# Altium project ece315-F21.PrjPcb (part 1 of 2)
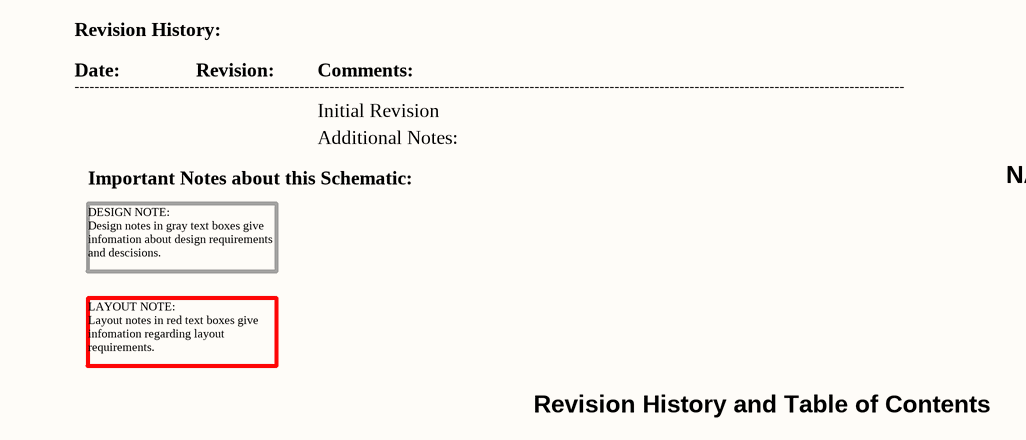
[diagram p0: 01-Revision_History_and_Contents.SchDoc]
8 sheets, 72 parts. Net scope: global (net labels, ports and power ports of the same name join across sheets).
Board file: ECE315_F21.PcbDoc
Sheets:
  01-Revision_History_and_Contents.SchDoc
  02-Power.SchDoc
  03_MCU.SchDoc
  04_Seven_Seg.SchDoc
  05_Seven_Seg.SchDoc
  06_CapTouch.SchDoc
  07_Buzzer.SchDoc
  08_Mechanicals.SchDoc

## Sheet 01-Revision_History_and_Contents.SchDoc: Revision History and Contents
size A; Date: 4/25/2017; ApprovedBy: JSK; CheckedBy: JSK; Author: JSK; CompanyName: University of Wisconsin; DrawnBy: JSK; Engineer: JSK; Organization: ECE 315; Address1: College of Engineering; Address2: 1415 Engineering Drive; Address3: Madison, WI 53706; Address4: ECE 453 Spring 2017; Revision: A; SheetNumber: 1; SheetTotal: 2

### Notes on the sheet
- Revision History:
- Date:
- ----------------------------------------------------------------------------------------------------------------------------------------------------------------------
- Revision:
- Comments:
- Initial Revision
- Important Notes about this Schematic:
- Additional Notes:
- NAME: <YOUR NAME>
- DESIGN NOTE:
  Design notes in gray text boxes give infomation about design requirements and descisions.
- LAYOUT NOTE:
  Layout notes in red text boxes give infomation regarding layout requirements.
- Revision History and Table of Contents

## Sheet 02-Power.SchDoc: ECE315 Analog
size A; Date: 4/25/2017; ApprovedBy: JSK; CheckedBy: JSK; Author: JSK; CompanyName: University of Wisconsin; DrawnBy: JSK; Engineer: JSK; Organization: ECE 315; Address1: College of Engineering; Address2: 1415 Engineering Drive; Address3: Madison, WI 53706; Address4: ECE 315 Fall 2017; Revision: A; SheetNumber: 2; SheetTotal: 2; AssemblyNumber: ECE315-F19; ApprovedDate: 04/02/2019
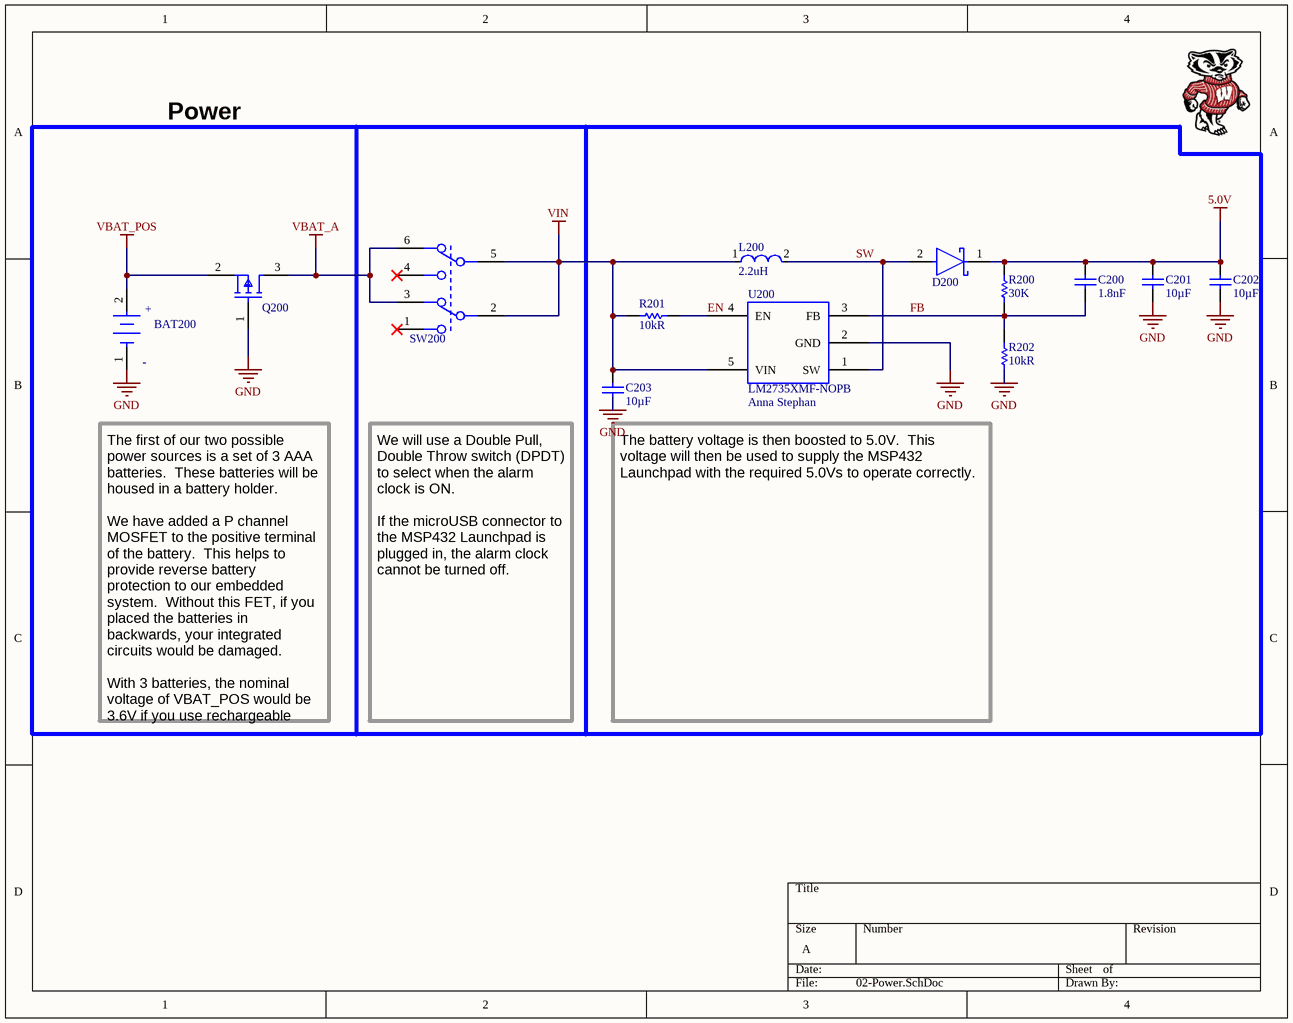
[diagram p1: 02-Power.SchDoc]

### Parts
BAT200  UNK_Keystone_2479_eec  [Keystone_2479_0]  (value not drawn)
C200  Capacitance: 1.8nF  [CAP_0805]  (hidden comment: CAP_0805_N_001_80)
C201  value 10µF  [CAP_0805]  (hidden comment: CAP_0805_U_010_00)
C202  value 10µF  [CAP_0805]  (hidden comment: CAP_0805_U_010_00)
C203  value 10µF  [CAP_0805]  (hidden comment: CAP_0805_U_010_00)
D200  SM5817PL-TP  [On_Semiconductor_425-04_IPC_A]  (value not drawn)
L200  Inductance: 2.2uH  [IND_TAIYO_NRS4018_TAY]  (hidden comment: NRS4018T2R2MDGJ)
Q200  SSM3J328R,LF  [SOT-23_M]  (value not drawn)
R200  30K  [RES_0805]
R201  Resistance: 10kR  [RES_0805]  (hidden comment: RES_0805_K_010.00)
R202  Resistance: 10kR  [RES_0805]  (hidden comment: RES_0805_K_010.00)
SW200  JS202011SCQN  [C&K_Components_0_MFG]  (value not drawn)
U200  Drawn_By: Anna Stephan  [LM2735-SOT23-S]  (hidden comment: LM2735XMF-NOPB)

### Blocks framed on the sheet
Power: BAT200 C200-C203 D200 L200 Q200 R200-R202 SW200 U200

### Nets
5.0V: C200.2 C201.2 C202.2 D200.1(C) R200.2
GND: BAT200.1(C) C201.1 C202.1 C203.1 Q200.1(Gate) R202.1 U200.2(GND)
VBAT_A: Q200.3(Drain) SW200.3 SW200.6
VBAT_POS: BAT200.2(A) Q200.2(Source)
VIN: C203.2 L200.1 R201.2 SW200.2 SW200.5 U200.5(VIN)
EN: R201.1 U200.4(EN)
FB: C200.1 R200.1 R202.2 U200.3(FB)
SW: D200.2(A) L200.2 U200.1(SW)

Not connected (* = marked no-connect by the designer): SW200 1* 4*

### Notes on the sheet
- The first of our two possible power sources is a set of 3 AAA batteries.  These batteries will be housed in a battery holder.
  We have added a P channel MOSFET to the positive terminal of the battery.  This helps to provide reverse battery protection to our embedded system.  Without this FET, if you placed the batteries in backwards, your integrated circuits would be damaged.
  With 3 batteries, the nominal voltage of VBAT_POS would be 3.6V if you use rechargeable NiMH batteries and 4.5V if you use lead acid batteries.
- (near C203) We will use a Double Pull, Double Throw switch (DPDT) to select when the alarm clock is ON.
  If the microUSB connector to the MSP432 Launchpad is plugged in, the alarm clock cannot be turned off.
- (near C203) The battery voltage is then boosted to 5.0V.  This voltage will then be used to supply the MSP432 Launchpad with the required 5.0Vs to operate correctly.
- (in symbol UNK_Keystone_2479_eec) +

### Library data of the parts
BAT200 = UNK_Keystone_2479_eec: BATTERY HOLDER AAA 3 CELL PC PIN; Part Number: 2479; Manufacturer 1: Keystone Electronics; Body Material: Polypropylene; Number of Batteries: 3; Wire/Cable Gauge: 26AWG; helpURL: https://upverter.com/upn/revision/5489a3afbecc8c6e/; ComponentLink2Description: Datasheet; Temperature: to; Package: CONN_BAT_HOLDER_3_AAA; Supplier 2: Mouser; Price: 1.03768733885; Supplier 1: Digi-Key; ComponentLink1URL: https://upverter.com/upn/revision/5489a3afbecc8c6e/; Supplier Part Number 2: 534-2479; Supplier Part Number 1: 36-2479-ND; Manufacturer: Keystone; ComponentLink1Description: Upverter; ComponentLink2URL: http://www.keyelco.com/product-pdf.cfm?p=1041; RoHS: TRUE; Mouser Part Number: 534-2479; Digikey Description: UNK HOLDER BATTERY 3CELL AAA PC MNT; Digikey Part Number: 36-2479-ND; Lead Free: yes; Mounting Type: PCB, Through Hole; Manufacturer Part Number 1: 2479; Category: Batteries and Accessories; Stock 1: 3670; Pricing 1: 1=1.71000, 25=1.49600, 100=1.19500, 250=1.09916, 500=1.03154, 1000=0.96389, 2500=0.87370, 5000=0.80043 (USD); Mount: Through Hole,PCB; Material: Steel,Plastic; Contact Material: Brass; Package Quantity: 1; Packaging: Bulk; Series: -; Number of Cells: 3; Termination: PC Pin; Contact Type: Spring; REACH SVHC: No SVHC; ComponentLink3URL: https://datasheet.ciiva.com/1391/1718224-1391618.pdf?src-supplier=Element14; ComponentLink3Description: https://datasheet.ciiva.com/1391/1718224-1391618.pdf?src-supplier=Element14; ComponentLink4URL: https://datasheet.ciiva.com/4/2479-4180.pdf?src-supplier=Digi-Key; ComponentLink4Description: https://datasheet.ciiva.com/4/2479-4180.pdf?src-supplier=Digi-Key; ComponentLink5URL: https://datasheet.ciiva.com/20221/18-3680-20221687.pdf?src-supplier=Rapid+Electronics; ComponentLink5Description: https://datasheet.ciiva.com/20221/18-3680-20221687.pdf?src-supplier=Rapid+Electronics
C200 = CAP_0805_N_001_80: MURATA - GRM2165C1H182JA01D - SMD Multilayer Ceramic Capacitor, 1800 pF, 50 V, 0805 [2012 Metric], ± 5%, C0G / NP0, GRM Series; Voltage Rating: 50V; Temperature Coefficient: 30ppm/°C; ComponentLink3URL: https://datasheet.ciiva.com/26920/getdatasheetpartid-355170-26920201.pdf; ComponentLink3Description: https://datasheet.ciiva.com/26920/getdatasheetpartid-355170-26920201.pdf; ComponentLink1URL: https://datasheet.ciiva.com/25730/cl21a106kpclqnc-25730594.pdf; ComponentLink1Description: https://datasheet.ciiva.com/25730/cl21a106kpclqnc-25730594.pdf; Supplier 1: Digi-Key; Supplier Part Number 1: 490-1626-1-ND; Manufacturer 1: Murata; Manufacturer Part Number 1: GRM2165C1H182JA01D; RoHS: Yes; Category: Ceramic Capacitors; Stock 1: 44565; Pricing 1: 1=0.20000, 10=0.14000, 50=0.08380, 100=0.07080, 500=0.04844, 1000=0.04285 (USD); Mount: Surface Mount; Case/Package: 0805; Case Code (Metric): 2012; Case Code (Imperial): 0805; Min Operating Temperature: -55°C; Max Operating Temperature: 125°C; Tolerance: 5%; Package Quantity: 1; Packaging: Tape and Reel; Voltage Rating (DC): 50V; Dielectric: C0G; Termination: SMD/SMT; Voltage: 50V; Series: GRM; Construction: Flat; Length: 2mm; Width: 0.049inch; Height: 0.6mm; Thickness: 0.028inch; Depth: 1.25mm; Radiation Hardening: No; REACH SVHC: No SVHC; Lead Free: Lead Free; RoHS Compliant: Yes; ComponentLink2URL: https://datasheet.ciiva.com/134/partnumbering-e-01-134098.pdf?src-supplier=Digi-Key; ComponentLink2Description: https://datasheet.ciiva.com/134/partnumbering-e-01-134098.pdf?src-supplier=Digi-Key; ComponentLink4URL: https://datasheet.ciiva.com/134/partnumbering-e-01-134100.pdf?src-supplier=Digi-Key; ComponentLink4Description: https://datasheet.ciiva.com/134/partnumbering-e-01-134100.pdf?src-supplier=Digi-Key; ComponentLink5URL: https://datasheet.ciiva.com/134/partnumbering-e-01-134099.pdf?src-supplier=Digi-Key; ComponentLink5Description: https://datasheet.ciiva.com/134/partnumbering-e-01-134099.pdf?src-supplier=Digi-Key
C201-C203 = CAP_0805_U_010_00: CAP CER 10UF 10V X5R 0805; Manufacturer: Samsung Electro-Mechanics America, Inc.; Manufacturer Part Number: CL21A106KPCLQNC; Tolerance: ±10%; Supplier 1: Digi-Key; Supplier Part Number 1: 1276-2402-1-ND; RoHS: RoHS Compliant; Category: Capacitors; Stock 1: 97192; Pricing 1: 1=0.2, 10=0.14, 25=0.1052, 50=0.0806, 100=0.0665, 500=0.0469, 1000=0.0385 (USD); Packaging: Cut Tape (CT); Voltage - Rated: 10V; Temperature Coefficient: X5R; Mounting Type: Surface Mount, MLCC; Operating Temperature: -55°C ~ 85°C; Applications: General Purpose; Ratings: -; Package / Case: 0805 (2012 Metric); Size / Dimension: 0.079" L x 0.049" W (2.00mm x 1.25mm); Height - Seated (Max): -; Thickness (Max): 0.037" (0.95mm); Lead Spacing: -; Features: -; Lead Style: -; ComponentLink1URL: http://media.digikey.com/pdf/Data%20Sheets/Samsung%20PDFs/CL21A106KPCLQNC_character.pdf; ComponentLink1Description: http://media.digikey.com/pdf/Data%20Sheets/Samsung%20PDFs/CL21A106KPCLQNC_character.pdf
D200 = SM5817PL-TP: DIODE SCHOTTKY 20V 1A SOD123FL; Forward Voltage: 450mV; Max Surge Current: 30A; Element Configuration: Single; Manufacturer 2: MCC; Manufacturer Part Number 2: SM5817PL-TP; RoHS: Yes; Category: Rectifier Diodes; Stock 2: 178040; Pricing 2: 1=0.46000, 10=0.31900, 100=0.16110, 500=0.13144, 1000=0.09752 (USD); Mount: Surface Mount; Number of Pins: 2; Min Operating Temperature: -65°C; Max Operating Temperature: 125°C; Packaging: Tape and Reel; Package Quantity: 1; Average Rectified Current: 1A; Peak Non-Repetitive Surge Current: 30A; Max Reverse Voltage (DC): 20V; Reverse Voltage: 20V; Radiation Hardening: No; RoHS Compliant: Yes; ComponentLink1URL: https://datasheet.ciiva.com/15200/getdatasheetpartid-487494-15200581.pdf?src-supplier=Verical; ComponentLink1Description: https://datasheet.ciiva.com/15200/getdatasheetpartid-487494-15200581.pdf?src-supplier=Verical; ComponentLink2URL: https://datasheet.ciiva.com/912/sm5817pl-sm5819plsod-123fl-912827.pdf?src-supplier=Digi-Key; ComponentLink2Description: https://datasheet.ciiva.com/912/sm5817pl-sm5819plsod-123fl-912827.pdf?src-supplier=Digi-Key; Supplier 1: Digi-Key; Supplier Part Number 1: SM5817PL-TPMSCT-ND
L200 = NRS4018T2R2MDGJ: Inductor Power Shielded Wirewound 2.2uH 20% 100KHz Ferrite 2.2A 0.0504Ohm DCR 1515 T/R; Manufacturer 1: Taiyo Yuden; Self Resonant Frequency: 60MHz; DC Resistance (DCR): 50.4mR; Max DC Current: 3A; ComponentLink1URL: https://datasheet.ciiva.com/8502/nr6028t2r2n-ss-8502679.pdf?src-supplier=Avnet; ComponentLink1Description: https://datasheet.ciiva.com/8502/nr6028t2r2n-ss-8502679.pdf?src-supplier=Avnet; ComponentLink2URL: https://datasheet.ciiva.com/15988/8nr6028t2r2n-15988110.pdf?src-supplier=Onlinecomponents.com; ComponentLink2Description: https://datasheet.ciiva.com/15988/8nr6028t2r2n-15988110.pdf?src-supplier=Onlinecomponents.com; ComponentLink3URL: https://datasheet.ciiva.com/7291/nr6028t2r2n-ss-7291637.pdf?src-supplier=Newark; ComponentLink3Description: https://datasheet.ciiva.com/7291/nr6028t2r2n-ss-7291637.pdf?src-supplier=Newark; ComponentLink4URL: https://datasheet.ciiva.com/1043/wound04-e-1043090.pdf?src-supplier=Digi-Key; ComponentLink4Description: https://datasheet.ciiva.com/1043/wound04-e-1043090.pdf?src-supplier=Digi-Key; ComponentLink5URL: https://datasheet.ciiva.com/1043/wound04-e-1043091.pdf?src-supplier=Digi-Key; ComponentLink5Description: https://datasheet.ciiva.com/1043/wound04-e-1043091.pdf?src-supplier=Digi-Key; ComponentLink6URL: https://datasheet.ciiva.com/1043/wound04-e-1043092.pdf?src-supplier=Digi-Key; ComponentLink6Description: https://datasheet.ciiva.com/1043/wound04-e-1043092.pdf?src-supplier=Digi-Key; Supplier 1: Digi-Key; Supplier Part Number 1: 587-2890-1-ND; Manufacturer Part Number 1: NRS4018T2R2MDGJ; RoHS: Yes; Category: Fixed Inductors; Stock 1: 291635; Pricing 1: 1=0.27000, 10=0.23800, 25=0.20840, 50=0.17860, 100=0.16370, 250=0.14884, 500=0.13990, 1000=0.10716 (USD); Mount: Surface Mount; Case/Package: Nonstandard; Number of Pins: 2; Core Material: Ferrite; Min Operating Temperature: -25°C; Max Operating Temperature: 125°C; Packaging: Tape and Reel; Tolerance: 20%; Package Quantity: 3500; Current Rating: 2.2A; Saturation Current: 3A; Shielding: Shielded; Resistor Type: Wirewound; Test Frequency: 100kHz; Termination: SMD/SMT; Inductance Tolerance: 20%; RMS Current (Irms): 2.2A; Series: NRS; Length: 4mm; Width: 0.157inch; Height: 1.8mm; Height - Seated (Max): 0.071inch; Depth: 4.2mm; Lead Pitch: 2.8mm; Radiation Hardening: No; Halogen Free: Halogen Free; Lead Free: Lead Free; RoHS Compliant: Yes; REACH SVHC: Unknown; ComponentLink7URL: https://datasheet.ciiva.com/8502/nrs4018t2r2mdgj-ss-8502646.pdf?src-supplier=Avnet; ComponentLink7Description: https://datasheet.ciiva.com/8502/nrs4018t2r2mdgj-ss-8502646.pdf?src-supplier=Avnet; ComponentLink8URL: https://datasheet.ciiva.com/7291/nrs4018t2r2mdgj-ss-7291680.pdf?src-supplier=Newark; ComponentLink8Description: https://datasheet.ciiva.com/7291/nrs4018t2r2mdgj-ss-7291680.pdf?src-supplier=Newark; ComponentLink9URL: https://datasheet.ciiva.com/25607/0900766b810b3cd2-25607949.pdf?src-supplier=RSComponents; ComponentLink9Description: https://datasheet.ciiva.com/25607/0900766b810b3cd2-25607949.pdf?src-supplier=RSComponents
Q200 = SSM3J328R,LF: MOSFET P-CH 20V 6A SOT23F; Manufacturer 1: Toshiba; Rds On Max: 29.8mR; Input Capacitance: 840pF; Max Power Dissipation: 1W; Gate to Source Voltage (Vgs): 8V; Turn-Off Delay Time: 107ns; Turn-On Delay Time: 32ns; Number of Channels: 1; Drain to Source Resistance: 47.4mR; Power Dissipation: 2W; Element Configuration: Single; Drain to Source Breakdown Voltage: -20V; Polarity: P-CHANNEL; Supplier 1: Digi-Key; Supplier Part Number 1: SSM3J328RLFCT-ND; Manufacturer Part Number 1: SSM3J328R,LF; RoHS: Yes; Category: MOSFETs; Stock 1: 476474; Pricing 1: 1=0.43000, 10=0.32200, 25=0.29040, 100=0.20060, 500=0.13728, 1000=0.10560 (USD); Mount: Surface Mount; Case/Package: SOT-23-3; Number of Pins: 3; Min Operating Temperature: -55°C; Max Operating Temperature: 150°C; Package Quantity: 3000; Packaging: Tape and Reel; Drain to Source Voltage (Vdss): 20V; Continuous Drain Current (ID): 6A; Number of Elements: 1; Radiation Hardening: No; RoHS Compliant: Yes; ComponentLink1URL: https://datasheet.ciiva.com/11158/ssm3j328r-datasheet-en-20140301-11158652.pdf?src-supplier=Avnet; ComponentLink1Description: https://datasheet.ciiva.com/11158/ssm3j328r-datasheet-en-20140301-11158652.pdf?src-supplier=Avnet; ComponentLink2URL: https://datasheet.ciiva.com/24106/ssm3j328r-datasheet-en-20140301-24106699.pdf?src-supplier=Mouser; ComponentLink2Description: https://datasheet.ciiva.com/24106/ssm3j328r-datasheet-en-20140301-24106699.pdf?src-supplier=Mouser; ComponentLink3URL: https://datasheet.ciiva.com/45425/ssm3j328r-datasheet-en-20140301-45425519.pdf?src-supplier=Digi-Key; ComponentLink3Description: https://datasheet.ciiva.com/45425/ssm3j328r-datasheet-en-20140301-45425519.pdf?src-supplier=Digi-Key; ComponentLink4URL: https://datasheet.ciiva.com/45425/ssm3j328r-datasheet-en-20140301-45425813.pdf?src-supplier=Digi-Key; ComponentLink4Description: https://datasheet.ciiva.com/45425/ssm3j328r-datasheet-en-20140301-45425813.pdf?src-supplier=Digi-Key
R200 = RES_0805_K_030.00: Res Thick Film 0805 30K Ohm 1% 0.125W(1/8W) ±100ppm/°C Pad SMD Automotive T/R; Manufacturer 1: Panasonic; Manufacturer Part Number 1: ERJ-6ENF3002V; Power Rating: 125mW; Voltage Rating: 150V; Supplier 1: Digi-Key; Supplier Part Number 1: P30.0KCCT-ND; RoHS: Yes; Category: Chip SMD Resistors; Stock 1: 296893; Pricing 1: 1=0.10000, 10=0.07500, 100=0.02880, 1000=0.01265, 2500=0.01092 (USD); Mount: Surface Mount; Case/Package: 0805; Case Code (Metric): 2012; Case Code (Imperial): 0805; Contact Plating: Tin; Weight: 0.000194oz; Min Operating Temperature: -55°C; Max Operating Temperature: 155°C; Tolerance: 1%; Packaging: Tape and Reel; Package Quantity: 1; Resistor Type: Thick Film; Number of Terminations: 2; Termination: SMD/SMT; Temperature Coefficient: 100ppm/°C; Max Power Dissipation: 125mW; Voltage Rating (DC): 150V; Features: Automotive AEC-Q200; Series: ERJ; Technology: THICK FILM; Resistance Tolerance: 1%; Construction: Rectangular; Length: 2mm; Width: 0.049inch; Height: 0.6mm; Depth: 1.25mm; Radiation Hardening: No; REACH SVHC: Unknown; Military Standard: Not; Lead Free: Lead Free; RoHS Compliant: Yes; ComponentLink1URL: https://datasheet.ciiva.com/11821/0900766b80f80784-11821600.pdf?src-supplier=RSComponents; ComponentLink1Description: https://datasheet.ciiva.com/11821/0900766b80f80784-11821600.pdf?src-supplier=RSComponents; ComponentLink2URL: https://datasheet.ciiva.com/9117/aoa0000ce2-9117485.pdf?src-supplier=Avnet; ComponentLink2Description: https://datasheet.ciiva.com/9117/aoa0000ce2-9117485.pdf?src-supplier=Avnet; ComponentLink3URL: https://datasheet.ciiva.com/24124/aoa0000ce2-24124393.pdf?src-supplier=Mouser; ComponentLink3Description: https://datasheet.ciiva.com/24124/aoa0000ce2-24124393.pdf?src-supplier=Mouser; ComponentLink4URL: https://datasheet.ciiva.com/30169/aoa0000ce2-30169447.pdf?src-supplier=Onlinecomponents.com; ComponentLink4Description: https://datasheet.ciiva.com/30169/aoa0000ce2-30169447.pdf?src-supplier=Onlinecomponents.com; ComponentLink5URL: https://datasheet.ciiva.com/17210/aoa0000ce2-17210478.pdf?src-supplier=Avnet+Europe; ComponentLink5Description: https://datasheet.ciiva.com/17210/aoa0000ce2-17210478.pdf?src-supplier=Avnet+Europe; ComponentLink6URL: https://datasheet.ciiva.com/22673/1678782-22673293.pdf?src-supplier=Element14; ComponentLink6Description: https://datasheet.ciiva.com/22673/1678782-22673293.pdf?src-supplier=Element14; ComponentLink7URL: https://datasheet.ciiva.com/28565/1694929-28565193.pdf?src-supplier=Element14; ComponentLink7Description: https://datasheet.ciiva.com/28565/1694929-28565193.pdf?src-supplier=Element14; ComponentLink8URL: https://datasheet.ciiva.com/46441/1678782-46441405.pdf?src-supplier=Element14; ComponentLink8Description: https://datasheet.ciiva.com/46441/1678782-46441405.pdf?src-supplier=Element14; ComponentLink9URL: https://datasheet.ciiva.com/46441/1678782-46441406.pdf?src-supplier=Element14; ComponentLink9Description: https://datasheet.ciiva.com/46441/1678782-46441406.pdf?src-supplier=Element14; ComponentLink10URL: https://datasheet.ciiva.com/16512/aoa0000ce2-16512236.pdf?src-supplier=Avnet+Asia; ComponentLink10Description: https://datasheet.ciiva.com/16512/aoa0000ce2-16512236.pdf?src-supplier=Avnet+Asia; ComponentLink11URL: https://datasheet.ciiva.com/7711/1678782-7711062.pdf?src-supplier=Element14; ComponentLink11Description: https://datasheet.ciiva.com/7711/1678782-7711062.pdf?src-supplier=Element14; Resistance: 30K
R201 R202 = RES_0805_K_010.00: RES SMD 10K OHM 1% 1/8W 0805; Manufacturer 1: Yageo; Manufacturer Part Number 1: RC0805FR-0710KL; Temperature Coefficient: 100ppm/°C; Power Rating: 125mW; Voltage Rating: 150V; Supplier 1: Digi-Key; Supplier Part Number 1: 311-10.0KCRCT-ND; Stock 1: 7562122; Pricing 1: 1=0.10000, 10=0.04200, 100=0.01690, 1000=0.00759, 2500=0.00659 (USD); RoHS: Yes; Case/Package: 0805; Case Code (Imperial): 0805; Case Code (Metric): 2012; Min Operating Temperature: -55°C; Max Operating Temperature: 155°C; Tolerance: 1%; Packaging: Tape and Reel; Features: Moisture Resistant; Termination: SMD/SMT; Number of Terminations: 2; Military Standard: Not; Max Power Dissipation: 125mW; Package Quantity: 1; Length: 2mm; Height: 0.024inch; Width: 0.049inch; Depth: 1.25mm; Lead Free: Lead Free; REACH SVHC: Unknown; ComponentLink1URL: https://datasheet.ciiva.com/11808/0900766b8106beab-11808151.pdf?src-supplier=RSComponents; ComponentLink1Description: https://datasheet.ciiva.com/11808/0900766b8106beab-11808151.pdf?src-supplier=RSComponents; ComponentLink2URL: https://datasheet.ciiva.com/12669/rc0805-12669688.pdf?src-supplier=Mouser; ComponentLink2Description: https://datasheet.ciiva.com/12669/rc0805-12669688.pdf?src-supplier=Mouser; ComponentLink3URL: https://datasheet.ciiva.com/46447/444164-46447563.pdf?src-supplier=Element14; ComponentLink3Description: https://datasheet.ciiva.com/46447/444164-46447563.pdf?src-supplier=Element14; ComponentLink4URL: https://datasheet.ciiva.com/2456/pyu-r-int-thick-7-2456972.pdf?src-supplier=Digi-Key; ComponentLink4Description: https://datasheet.ciiva.com/2456/pyu-r-int-thick-7-2456972.pdf?src-supplier=Digi-Key; ComponentLink5URL: https://datasheet.ciiva.com/2456/pyu-r-int-thick-7-2456973.pdf?src-supplier=Digi-Key; ComponentLink5Description: https://datasheet.ciiva.com/2456/pyu-r-int-thick-7-2456973.pdf?src-supplier=Digi-Key; ComponentLink6URL: https://datasheet.ciiva.com/2456/pyu-r-int-thick-7-2456974.pdf?src-supplier=Digi-Key; ComponentLink6Description: https://datasheet.ciiva.com/2456/pyu-r-int-thick-7-2456974.pdf?src-supplier=Digi-Key; ComponentLink7URL: https://datasheet.ciiva.com/16747/rc0805-16747087.pdf?src-supplier=Future+Electronics; ComponentLink7Description: https://datasheet.ciiva.com/16747/rc0805-16747087.pdf?src-supplier=Future+Electronics; Category: Chip SMD Resistors; Size Code: 0805; Resistor Type: Thick Film; Series: RC; Construction: Rectangular; Resistance Tolerance: 1%; Technology: THICK FILM; RoHS Compliant: Yes
SW200 = JS202011SCQN: C & K COMPONENTS - JS202011SCQN - SWITCH, DPDT, 0.6A, 6VDC, SMD; Manufacturer 1: ITT C&K; Actuator Material: Nylon,Polyamide,PA46; Actuator Color: Black; Voltage Rating (DC): 6V; Current Rating: 300mA; Electrical Life: 5000Cycles; Switch Function: On-On; Contact Resistance: 70mR; Switch Travel: 2mm; Actuator Type: Standard; Supplier 1: Digi-Key; Supplier Part Number 1: 401-2002-1-ND; Manufacturer Part Number 1: JS202011SCQN; RoHS: Yes; Category: Slide Switches; Stock 1: 21096; Pricing 1: 1=0.55000, 10=0.53000, 25=0.51040, 100=0.44180, 250=0.40252, 500=0.37306 (USD); Mount: Surface Mount; Contact Plating: Silver; Contact Material: Copper Alloy; Housing Material: Nylon; Min Operating Temperature: -20°C; Max Operating Temperature: 85°C; Throw Configuration: DPDT; Packaging: Tape and Reel; Package Quantity: 1; Termination: Gull Wing; Max Voltage Rating (DC): 6V; Series: JS; Max Current Rating: 300mA; Contact Current Rating: 300mA; Orientation: Vertical; Length: 9mm; Depth: 7.5mm; Actuator Length: 2mm; Radiation Hardening: No; REACH SVHC: No SVHC; Lead Free: Lead Free; Flammability Rating: UL94 V-2; ComponentLink1URL: https://datasheet.ciiva.com/2889/js-29aug13-2889127.pdf?src-supplier=Digi-Key; ComponentLink1Description: https://datasheet.ciiva.com/2889/js-29aug13-2889127.pdf?src-supplier=Digi-Key; ComponentLink2URL: https://datasheet.ciiva.com/23829/1707718-23829488.pdf?src-supplier=Newark; ComponentLink2Description: https://datasheet.ciiva.com/23829/1707718-23829488.pdf?src-supplier=Newark; ComponentLink3URL: https://datasheet.ciiva.com/8625/js-9dec14-8625470.pdf?src-supplier=Avnet; ComponentLink3Description: https://datasheet.ciiva.com/8625/js-9dec14-8625470.pdf?src-supplier=Avnet; ComponentLink4URL: https://datasheet.ciiva.com/2889/js-15sept15-2889128.pdf?src-supplier=Digi-Key; ComponentLink4Description: https://datasheet.ciiva.com/2889/js-15sept15-2889128.pdf?src-supplier=Digi-Key; ComponentLink5URL: https://datasheet.ciiva.com/2889/js-15sept15-2889129.pdf?src-supplier=Digi-Key; ComponentLink5Description: https://datasheet.ciiva.com/2889/js-15sept15-2889129.pdf?src-supplier=Digi-Key; ComponentLink6URL: https://datasheet.ciiva.com/22630/1707718-22630697.pdf?src-supplier=Element14; ComponentLink6Description: https://datasheet.ciiva.com/22630/1707718-22630697.pdf?src-supplier=Element14
U200 = LM2735XMF-NOPB: IC REG MULT CONFG ADJ 2.1A SOT23; Manufacturer 1: TI National Semiconductor; Max Input Voltage: 5.5V; Max Output Current: 3A; Min Supply Voltage: 2.7V; Output Voltage: 24V; Switching Frequency: 1.6MHz; Nominal Supply Current: 500uA; Efficiency: 90%; Number of Outputs: 1; Synchronous Rectifier: No; Min Output Voltage: 3V; Quiescent Current: 7mA; Topology: Boost,SEPIC; Output Type: Adjustable; Supplier 1: Digi-Key; RoHS: Yes; Category: Voltage Regulators - Switching; Stock 1: 5135; Pricing 1: 1=2.27000, 10=2.03900, 25=1.92400, 100=1.63920, 250=1.53912, 500=1.34672 (USD); Mount: Surface Mount; Case/Package: SOT-23; Number of Pins: 5; Contact Plating: Tin,Matte; Min Operating Temperature: -40°C; Max Operating Temperature: 125°C; Output Current: 3A; Min Input Voltage: 2.7V; Packaging: Tape and Reel; Package Quantity: 1000; Max Output Voltage: 24V; Operating Supply Voltage: 5.5V; Series: LM2735; Supply Current: 500uA; Length: 2.92mm; Width: 1.6mm; Height: 1.02mm; Radiation Hardening: No; REACH SVHC: No SVHC; Lead Free: Lead Free; RoHS Compliant: Yes; ComponentLink1URL: https://datasheet.ciiva.com/22669/1802021-22669478.pdf?src-supplier=Element14; ComponentLink1Description: https://datasheet.ciiva.com/22669/1802021-22669478.pdf?src-supplier=Element14; Supplier Part Number 1: LM2735XMF/NOPBCT-ND

## Sheet 03_MCU.SchDoc: ECE315 MCU
size A; Date: 4/25/2017; ApprovedBy: JSK; CheckedBy: JSK; Author: JSK; CompanyName: University of Wisconsin; DrawnBy: JSK; Engineer: JSK; Organization: ECE 315; Address1: College of Engineering; Address2: 1415 Engineering Drive; Address3: Madison, WI 53706; Address4: ECE 315 Fall 2017; Revision: A; SheetNumber: 3; SheetTotal: 6; AssemblyNumber: ECE315-F19; ApprovedDate: 04/02/2019
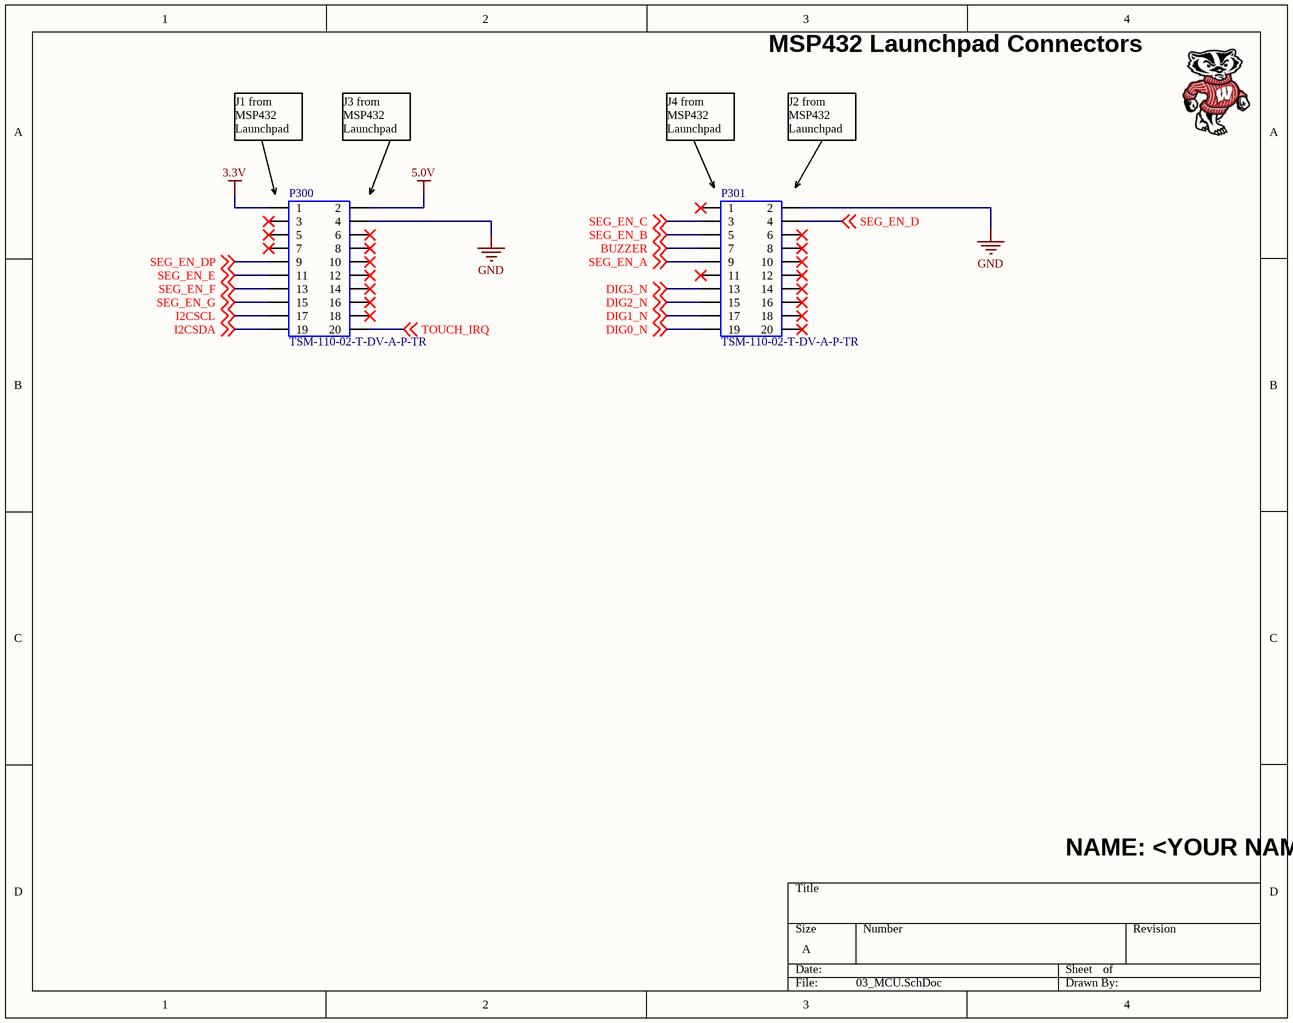
[diagram p2: 03_MCU.SchDoc]

### Parts
P300  Manufacturer Part Number: TSM-110-02-T-DV-A-P-TR  [TMS-110-01-T-DV-A]  (hidden comment: 20 Pin SMD)
P301  Manufacturer Part Number: TSM-110-02-T-DV-A-P-TR  [TMS-110-01-T-DV-A]  (hidden comment: 20 Pin SMD)

### Nets
3.3V: P300.1
5.0V: P300.2
GND: P300.4 P301.2
BUZZER: P301.7 ; off-sheet BUZZER
DIG0_N: P301.19 ; off-sheet DIG0_N
DIG1_N: P301.17 ; off-sheet DIG1_N
DIG2_N: P301.15 ; off-sheet DIG2_N
DIG3_N: P301.13 ; off-sheet DIG3_N
I2CSCL: P300.17 ; off-sheet I2CSCL
I2CSDA: P300.19 ; off-sheet I2CSDA
SEG_EN_A: P301.9 ; off-sheet SEG_EN_A
SEG_EN_B: P301.5 ; off-sheet SEG_EN_B
SEG_EN_C: P301.3 ; off-sheet SEG_EN_C
SEG_EN_D: P301.4 ; off-sheet SEG_EN_D
SEG_EN_DP: P300.9 ; off-sheet SEG_EN_DP
SEG_EN_E: P300.11 ; off-sheet SEG_EN_E
SEG_EN_F: P300.13 ; off-sheet SEG_EN_F
SEG_EN_G: P300.15 ; off-sheet SEG_EN_G
TOUCH_IRQ: P300.20 ; off-sheet TOUCH_IRQ

Not connected (* = marked no-connect by the designer): P300 3* 5* 6* 7* 8* 10* 12* 14* 16* 18*; P301 1* 6* 8* 10* 11* 12* 14* 16* 18* 20*

### Notes on the sheet
- MSP432 Launchpad Connectors
- J1 from MSP432 Launchpad
- J3 from MSP432 Launchpad
- J4 from MSP432 Launchpad
- J2 from MSP432 Launchpad
- NAME: <YOUR NAME>

### Library data of the parts
P300 P301 = TSM-110-02-T-DV-A: Conn Unshrouded Header HDR 20 POS 2.54mm Solder ST SMD Tube; Supplier 1: Newark; Supplier Part Number 1: 78P2391

## Sheet 04_Seven_Seg.SchDoc: ECE315 Analog
size A; Date: 4/25/2017; ApprovedBy: JSK; CheckedBy: JSK; Author: JSK; CompanyName: University of Wisconsin; DrawnBy: JSK; Engineer: JSK; Organization: ECE 315; Address1: College of Engineering; Address2: 1415 Engineering Drive; Address3: Madison, WI 53706; Address4: ECE 315 Fall 2017; Revision: A; SheetNumber: 2; SheetTotal: 2; AssemblyNumber: ECE315-F19; ApprovedDate: 04/02/2019
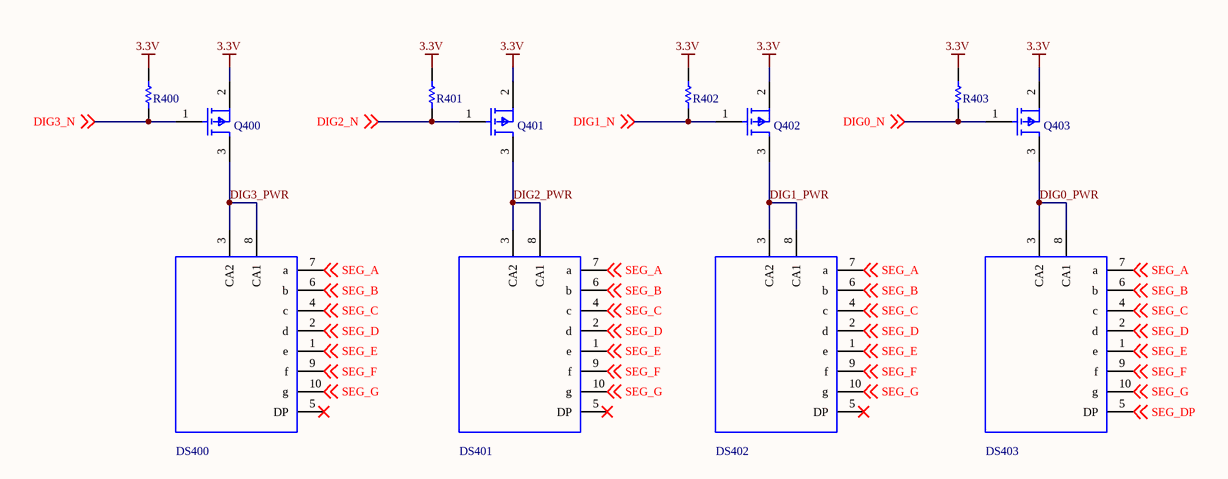
[diagram p3: 04_Seven_Seg.SchDoc]

### Parts
DS400  ACSA56-41CGKWA-F01  [ACSA56-41CGKWA-F01]  (value not drawn)
DS401  ACSA56-41CGKWA-F01  [ACSA56-41CGKWA-F01]  (value not drawn)
DS402  ACSA56-41CGKWA-F01  [ACSA56-41CGKWA-F01]  (value not drawn)
DS403  ACSA56-41CGKWA-F01  [ACSA56-41CGKWA-F01]  (value not drawn)
Q400  SSM3J328R,LF  [SOT-23_M]  (value not drawn)
Q401  SSM3J328R,LF  [SOT-23_M]  (value not drawn)
Q402  SSM3J328R,LF  [SOT-23_M]  (value not drawn)
Q403  SSM3J328R,LF  [SOT-23_M]  (value not drawn)
R400  RES_0805_K_010.00  [RES_0805]  (value not drawn)
R401  RES_0805_K_010.00  [RES_0805]  (value not drawn)
R402  RES_0805_K_010.00  [RES_0805]  (value not drawn)
R403  RES_0805_K_010.00  [RES_0805]  (value not drawn)

### Nets
3.3V: Q400.2(Source) Q401.2(Source) Q402.2(Source) Q403.2(Source) R400.2 R401.2 R402.2 R403.2
DIG0_N: Q403.1(Gate) R403.1 ; off-sheet DIG0_N
DIG0_PWR: DS403.3(CA2) DS403.8(CA1) Q403.3(Drain)
DIG1_N: Q402.1(Gate) R402.1 ; off-sheet DIG1_N
DIG1_PWR: DS402.3(CA2) DS402.8(CA1) Q402.3(Drain)
DIG2_N: Q401.1(Gate) R401.1 ; off-sheet DIG2_N
DIG2_PWR: DS401.3(CA2) DS401.8(CA1) Q401.3(Drain)
DIG3_N: Q400.1(Gate) R400.1 ; off-sheet DIG3_N
DIG3_PWR: DS400.3(CA2) DS400.8(CA1) Q400.3(Drain)
SEG_A: DS400.7(a) DS401.7(a) DS402.7(a) DS403.7(a) ; off-sheet SEG_A
SEG_B: DS400.6(b) DS401.6(b) DS402.6(b) DS403.6(b) ; off-sheet SEG_B
SEG_C: DS400.4(c) DS401.4(c) DS402.4(c) DS403.4(c) ; off-sheet SEG_C
SEG_D: DS400.2(d) DS401.2(d) DS402.2(d) DS403.2(d) ; off-sheet SEG_D
SEG_DP: DS403.5(DP) ; off-sheet SEG_DP
SEG_E: DS400.1(e) DS401.1(e) DS402.1(e) DS403.1(e) ; off-sheet SEG_E
SEG_F: DS400.9(f) DS401.9(f) DS402.9(f) DS403.9(f) ; off-sheet SEG_F
SEG_G: DS400.10(g) DS401.10(g) DS402.10(g) DS403.10(g) ; off-sheet SEG_G

Not connected (* = marked no-connect by the designer): DS400 5(DP)*; DS401 5(DP)*; DS402 5(DP)*

### Library data of the parts
DS400-DS403 = ACSA56-41CGKWA-F01: DISPLAY 0.56" SGL 574NM GRN SMD; Manufacturer 1: Kingbright; Color: Green; Power Consumption: 75mW; Number of Characters: 1; Element Configuration: Common Anode; Forward Current: 30mA; Forward Voltage: 2.1V; Wavelength: 570nm; Test Current: 20mA; Luminous Intensity: 25mcd; Display Type: Segment; Supplier 1: Digi-Key; Supplier Part Number 1: 754-1033-1-ND; Manufacturer Part Number 1: ACSA56-41CGKWA-F01; RoHS: Yes; Category: LED Displays; Stock 1: 38128; Pricing 1: 1=3.38000, 10=2.25300, 100=1.73360 (USD); Case/Package: SMD/SMT; Min Operating Temperature: -40°C; Max Operating Temperature: 85°C; Package Quantity: 400; Max Power Dissipation: 75mW; Illumination Color: Green; Packaging: Rail/Tube; Operating Supply Voltage: 2.1V; Width: 0.488inch; Height: 0.669inch; RoHS Compliant: Yes; Lead Free: Lead Free; ComponentLink1URL: https://datasheet.ciiva.com/2103/acsa56-41cgkwa-f01-2103794.pdf?src-supplier=Digi-Key; ComponentLink1Description: https://datasheet.ciiva.com/2103/acsa56-41cgkwa-f01-2103794.pdf?src-supplier=Digi-Key; ComponentLink2URL: https://datasheet.ciiva.com/4421/acsa56-41cgkwa-f01-17964-4421697.pdf?src-supplier=Mouser; ComponentLink2Description: https://datasheet.ciiva.com/4421/acsa56-41cgkwa-f01-17964-4421697.pdf?src-supplier=Mouser; ComponentLink3URL: https://datasheet.ciiva.com/16287/acsa56-41cgkwa-f01-16287523.pdf?src-supplier=Future+Electronics; ComponentLink3Description: https://datasheet.ciiva.com/16287/acsa56-41cgkwa-f01-16287523.pdf?src-supplier=Future+Electronics; ComponentLink4URL: https://datasheet.ciiva.com/2103/acsa56-41cgkwa-f01-2103795.pdf?src-supplier=Digi-Key; ComponentLink4Description: https://datasheet.ciiva.com/2103/acsa56-41cgkwa-f01-2103795.pdf?src-supplier=Digi-Key; ComponentLink5URL: https://datasheet.ciiva.com/2103/acsa56-41cgkwa-f01-2103796.pdf?src-supplier=Digi-Key; ComponentLink5Description: https://datasheet.ciiva.com/2103/acsa56-41cgkwa-f01-2103796.pdf?src-supplier=Digi-Key
Q400-Q403 = SSM3J328R,LF: as Q200 on sheet 02-Power; Supplier 1: Digi-Key; Supplier Part Number 1: SSM3J328RLFCT-ND; Manufacturer Part Number 1: SSM3J328R,LF; RoHS: Yes; Category: MOSFETs; Stock 1: 476474; Pricing 1: 1=0.43000, 10=0.32200, 25=0.29040, 100=0.20060, 500=0.13728, 1000=0.10560 (USD); Mount: Surface Mount; Case/Package: SOT-23-3; Number of Pins: 3; Min Operating Temperature: -55°C; Max Operating Temperature: 150°C; Package Quantity: 3000; Packaging: Tape and Reel; Drain to Source Voltage (Vdss): 20V; Continuous Drain Current (ID): 6A; Number of Elements: 1; Radiation Hardening: No; RoHS Compliant: Yes; ComponentLink1URL: https://datasheet.ciiva.com/11158/ssm3j328r-datasheet-en-20140301-11158652.pdf?src-supplier=Avnet; ComponentLink1Description: https://datasheet.ciiva.com/11158/ssm3j328r-datasheet-en-20140301-11158652.pdf?src-supplier=Avnet; ComponentLink2URL: https://datasheet.ciiva.com/24106/ssm3j328r-datasheet-en-20140301-24106699.pdf?src-supplier=Mouser; ComponentLink2Description: https://datasheet.ciiva.com/24106/ssm3j328r-datasheet-en-20140301-24106699.pdf?src-supplier=Mouser; ComponentLink3URL: https://datasheet.ciiva.com/45425/ssm3j328r-datasheet-en-20140301-45425519.pdf?src-supplier=Digi-Key; ComponentLink3Description: https://datasheet.ciiva.com/45425/ssm3j328r-datasheet-en-20140301-45425519.pdf?src-supplier=Digi-Key; ComponentLink4URL: https://datasheet.ciiva.com/45425/ssm3j328r-datasheet-en-20140301-45425813.pdf?src-supplier=Digi-Key; ComponentLink4Description: https://datasheet.ciiva.com/45425/ssm3j328r-datasheet-en-20140301-45425813.pdf?src-supplier=Digi-Key
R400-R403 = RES_0805_K_010.00: RES SMD 10K OHM 1% 1/8W 0805; Manufacturer 1: Yageo; Manufacturer Part Number 1: RC0805FR-0710KL; Temperature Coefficient: 100ppm/°C; Power Rating: 125mW; Voltage Rating: 150V; Resistance: 10kR; Supplier 1: Digi-Key; Supplier Part Number 1: 311-10.0KCRCT-ND; Stock 1: 7562122; Pricing 1: 1=0.10000, 10=0.04200, 100=0.01690, 1000=0.00759, 2500=0.00659 (USD); RoHS: Yes; Case/Package: 0805; Case Code (Imperial): 0805; Case Code (Metric): 2012; Min Operating Temperature: -55°C; Max Operating Temperature: 155°C; Tolerance: 1%; Packaging: Tape and Reel; Features: Moisture Resistant; Termination: SMD/SMT; Number of Terminations: 2; Military Standard: Not; Max Power Dissipation: 125mW; Package Quantity: 1; Length: 2mm; Height: 0.024inch; Width: 0.049inch; Depth: 1.25mm; Lead Free: Lead Free; REACH SVHC: Unknown; ComponentLink1URL: https://datasheet.ciiva.com/11808/0900766b8106beab-11808151.pdf?src-supplier=RSComponents; ComponentLink1Description: https://datasheet.ciiva.com/11808/0900766b8106beab-11808151.pdf?src-supplier=RSComponents; ComponentLink2URL: https://datasheet.ciiva.com/12669/rc0805-12669688.pdf?src-supplier=Mouser; ComponentLink2Description: https://datasheet.ciiva.com/12669/rc0805-12669688.pdf?src-supplier=Mouser; ComponentLink3URL: https://datasheet.ciiva.com/46447/444164-46447563.pdf?src-supplier=Element14; ComponentLink3Description: https://datasheet.ciiva.com/46447/444164-46447563.pdf?src-supplier=Element14; ComponentLink4URL: https://datasheet.ciiva.com/2456/pyu-r-int-thick-7-2456972.pdf?src-supplier=Digi-Key; ComponentLink4Description: https://datasheet.ciiva.com/2456/pyu-r-int-thick-7-2456972.pdf?src-supplier=Digi-Key; ComponentLink5URL: https://datasheet.ciiva.com/2456/pyu-r-int-thick-7-2456973.pdf?src-supplier=Digi-Key; ComponentLink5Description: https://datasheet.ciiva.com/2456/pyu-r-int-thick-7-2456973.pdf?src-supplier=Digi-Key; ComponentLink6URL: https://datasheet.ciiva.com/2456/pyu-r-int-thick-7-2456974.pdf?src-supplier=Digi-Key; ComponentLink6Description: https://datasheet.ciiva.com/2456/pyu-r-int-thick-7-2456974.pdf?src-supplier=Digi-Key; ComponentLink7URL: https://datasheet.ciiva.com/16747/rc0805-16747087.pdf?src-supplier=Future+Electronics; ComponentLink7Description: https://datasheet.ciiva.com/16747/rc0805-16747087.pdf?src-supplier=Future+Electronics; Category: Chip SMD Resistors; Size Code: 0805; Resistor Type: Thick Film; Series: RC; Construction: Rectangular; Resistance Tolerance: 1%; Technology: THICK FILM; RoHS Compliant: Yes

## Sheet 05_Seven_Seg.SchDoc: ECE315 Analog
size A; Date: 4/25/2017; ApprovedBy: JSK; CheckedBy: JSK; Author: JSK; CompanyName: University of Wisconsin; DrawnBy: JSK; Engineer: JSK; Organization: ECE 315; Address1: College of Engineering; Address2: 1415 Engineering Drive; Address3: Madison, WI 53706; Address4: ECE 315 Fall 2017; Revision: A; SheetNumber: 2; SheetTotal: 2; AssemblyNumber: ECE315-F19; ApprovedDate: 04/02/2019
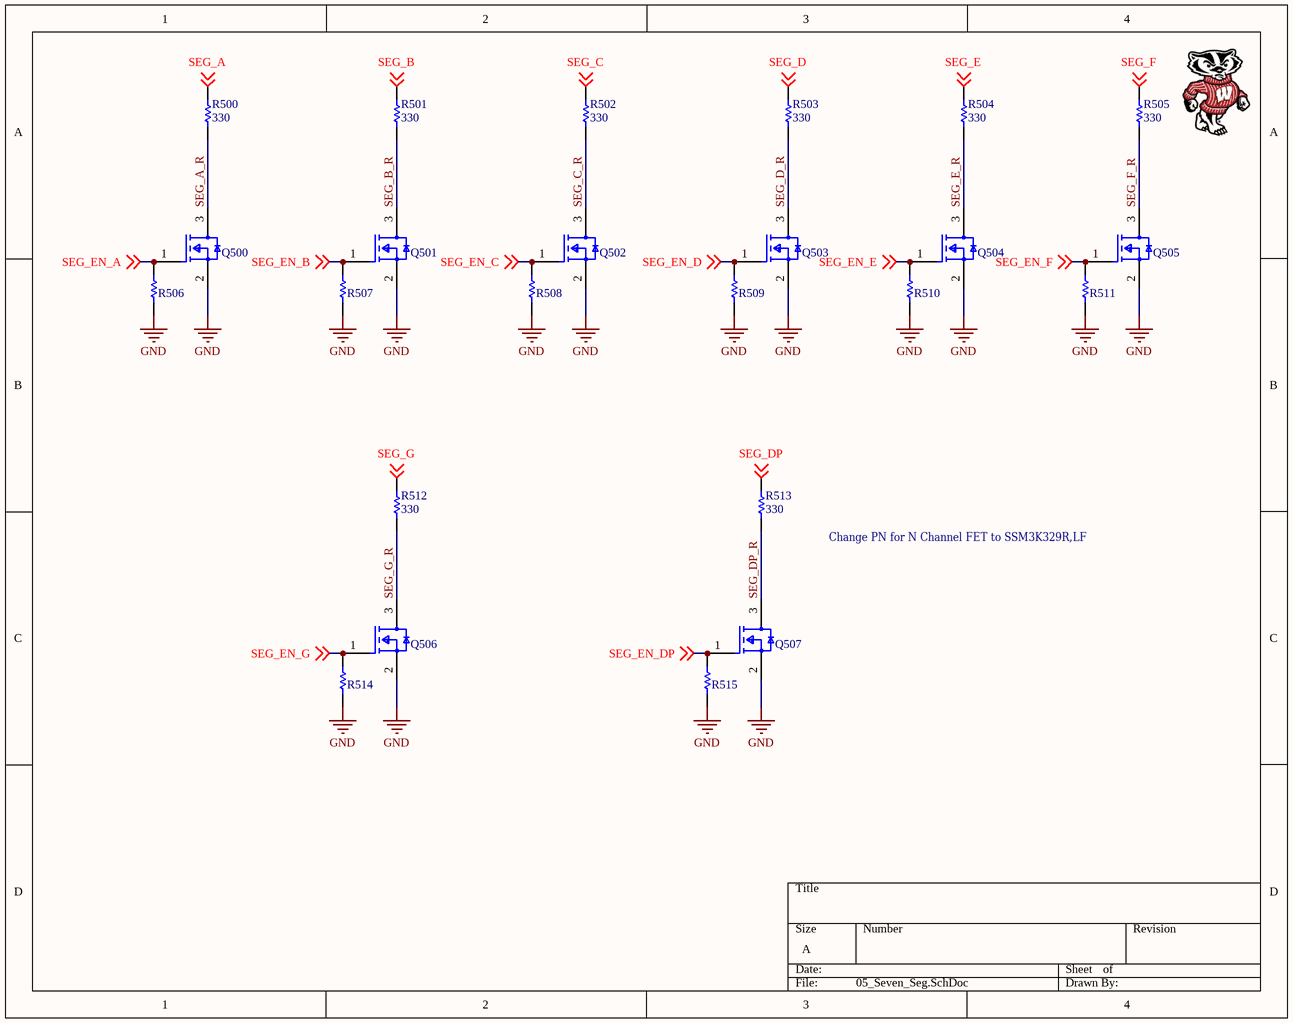
[diagram p4: 05_Seven_Seg.SchDoc]

### Parts
Q500  NDS7002A  [Diodes_Inc_SOT23_IPC_A]  (value not drawn)
Q501  NDS7002A  [Diodes_Inc_SOT23_IPC_A]  (value not drawn)
Q502  NDS7002A  [Diodes_Inc_SOT23_IPC_A]  (value not drawn)
Q503  NDS7002A  [Diodes_Inc_SOT23_IPC_A]  (value not drawn)
Q504  NDS7002A  [Diodes_Inc_SOT23_IPC_A]  (value not drawn)
Q505  NDS7002A  [Diodes_Inc_SOT23_IPC_A]  (value not drawn)
Q506  NDS7002A  [Diodes_Inc_SOT23_IPC_A]  (value not drawn)
Q507  NDS7002A  [Diodes_Inc_SOT23_IPC_A]  (value not drawn)
R500  330  [RES_0805]
R501  330  [RES_0805]
R502  330  [RES_0805]
R503  330  [RES_0805]
R504  330  [RES_0805]
R505  330  [RES_0805]
R506  RES_0805_K_010.00  [RES_0805]  (value not drawn)
R507  RES_0805_K_010.00  [RES_0805]  (value not drawn)
R508  RES_0805_K_010.00  [RES_0805]  (value not drawn)
R509  RES_0805_K_010.00  [RES_0805]  (value not drawn)
R510  RES_0805_K_010.00  [RES_0805]  (value not drawn)
R511  RES_0805_K_010.00  [RES_0805]  (value not drawn)
R512  330  [RES_0805]
R513  330  [RES_0805]
R514  RES_0805_K_010.00  [RES_0805]  (value not drawn)
R515  RES_0805_K_010.00  [RES_0805]  (value not drawn)

### Nets
GND: Q500.2(S) Q501.2(S) Q502.2(S) Q503.2(S) Q504.2(S) Q505.2(S) Q506.2(S) Q507.2(S) R506.1 R507.1 R508.1 R509.1 R510.1 R511.1 R514.1 R515.1
SEG_A: R500.2 ; off-sheet SEG_A
SEG_A_R: Q500.3(D) R500.1
SEG_B: R501.2 ; off-sheet SEG_B
SEG_B_R: Q501.3(D) R501.1
SEG_C: R502.2 ; off-sheet SEG_C
SEG_C_R: Q502.3(D) R502.1
SEG_D: R503.2 ; off-sheet SEG_D
SEG_D_R: Q503.3(D) R503.1
SEG_DP: R513.2 ; off-sheet SEG_DP
SEG_DP_R: Q507.3(D) R513.1
SEG_E: R504.2 ; off-sheet SEG_E
SEG_E_R: Q504.3(D) R504.1
SEG_EN_A: Q500.1(G) R506.2 ; off-sheet SEG_EN_A
SEG_EN_B: Q501.1(G) R507.2 ; off-sheet SEG_EN_B
SEG_EN_C: Q502.1(G) R508.2 ; off-sheet SEG_EN_C
SEG_EN_D: Q503.1(G) R509.2 ; off-sheet SEG_EN_D
SEG_EN_DP: Q507.1(G) R515.2 ; off-sheet SEG_EN_DP
SEG_EN_E: Q504.1(G) R510.2 ; off-sheet SEG_EN_E
SEG_EN_F: Q505.1(G) R511.2 ; off-sheet SEG_EN_F
SEG_EN_G: Q506.1(G) R514.2 ; off-sheet SEG_EN_G
SEG_F: R505.2 ; off-sheet SEG_F
SEG_F_R: Q505.3(D) R505.1
SEG_G: R512.2 ; off-sheet SEG_G
SEG_G_R: Q506.3(D) R512.1

### Notes on the sheet
- Change PN for N Channel FET to SSM3K329R,LF‎

### Library data of the parts
Q500-Q507 = NDS7002A: FAIRCHILD SEMICONDUCTOR         NDS7002A.            MOSFET, FULL REEL; Manufacturer 1: ON Semiconductor / Fairchild; Drain to Source Voltage (Vdss): 60V; Continuous Drain Current (ID): 280mA; Power Dissipation: 300mW; Drain to Source Resistance: 1.2R; Gate to Source Voltage (Vgs): 20V; Rds On Max: 2R; Input Capacitance: 50pF; Nominal Vgs: 2.1V; Number of Elements: 1; Element Configuration: Single; ComponentLink1URL: https://datasheet.ciiva.com/29746/dmn6140l-29746783.pdf?src-supplier=Digi-Key; ComponentLink1Description: https://datasheet.ciiva.com/29746/dmn6140l-29746783.pdf?src-supplier=Digi-Key; ComponentLink2URL: https://datasheet.ciiva.com/4444/ds30896-81375-4444887.pdf?src-supplier=Mouser; ComponentLink2Description: https://datasheet.ciiva.com/4444/ds30896-81375-4444887.pdf?src-supplier=Mouser; ComponentLink3URL: https://datasheet.ciiva.com/1254/ds30896-1254496.pdf?src-supplier=Newark; ComponentLink3Description: https://datasheet.ciiva.com/1254/ds30896-1254496.pdf?src-supplier=Newark; ComponentLink4URL: https://datasheet.ciiva.com/25624/0900766b81151e8c-25624936.pdf?src-supplier=RSComponents; ComponentLink4Description: https://datasheet.ciiva.com/25624/0900766b81151e8c-25624936.pdf?src-supplier=RSComponents; ComponentLink5URL: https://datasheet.ciiva.com/15137/getdatasheetpartid-75159-15137378.pdf?src-supplier=Verical; ComponentLink5Description: https://datasheet.ciiva.com/15137/getdatasheetpartid-75159-15137378.pdf?src-supplier=Verical; ComponentLink6URL: https://datasheet.ciiva.com/48532/ds30896-48532645.pdf?src-supplier=Avnet; ComponentLink6Description: https://datasheet.ciiva.com/48532/ds30896-48532645.pdf?src-supplier=Avnet; ComponentLink7URL: https://datasheet.ciiva.com/1188/ds30896-1188422.pdf?src-supplier=Element14; ComponentLink7Description: https://datasheet.ciiva.com/1188/ds30896-1188422.pdf?src-supplier=Element14; ComponentLink8URL: https://datasheet.ciiva.com/16200/ds30896-16200842.pdf?src-supplier=Future+Electronics; ComponentLink8Description: https://datasheet.ciiva.com/16200/ds30896-16200842.pdf?src-supplier=Future+Electronics; ComponentLink9URL: https://datasheet.ciiva.com/17323/ds30896-17323945.pdf?src-supplier=Avnet+Europe; ComponentLink9Description: https://datasheet.ciiva.com/17323/ds30896-17323945.pdf?src-supplier=Avnet+Europe; Supplier 1: Digi-Key; Supplier Part Number 1: NDS7002ACT-ND; Manufacturer Part Number 1: NDS7002A; RoHS: Yes; Category: MOSFETs; Stock 1: 640812; Pricing 1: 1=0.38000, 10=0.28600, 25=0.25040, 100=0.16190, 500=0.10724, 1000=0.08222 (USD); Mount: Surface Mount; Case/Package: SOT-23; Number of Pins: 3; Contact Plating: Tin,Matte; Min Operating Temperature: -65°C; Max Operating Temperature: 150°C; Packaging: Tape and Reel; Drain to Source Breakdown Voltage: 60V; Voltage Rating (DC): 60V; Current Rating: 280mA; Package Quantity: 1; Dual Supply Voltage: 60V; Max Power Dissipation: 300mW; Threshold Voltage: 2.1V; Voltage: 60V; On-State Resistance: 2R; Width: 3.05mm; Radiation Hardening: No; REACH SVHC: No SVHC; Lead Free: Lead Free; RoHS Compliant: Yes; ComponentLink10URL: https://datasheet.ciiva.com/15137/getdatasheetpartid-44394-15137140.pdf?src-supplier=Verical; ComponentLink10Description: https://datasheet.ciiva.com/15137/getdatasheetpartid-44394-15137140.pdf?src-supplier=Verical; ComponentLink11URL: https://datasheet.ciiva.com/34301/874832-34301640.pdf?src-supplier=Jameco; ComponentLink11Description: https://datasheet.ciiva.com/34301/874832-34301640.pdf?src-supplier=Jameco; ComponentLink12URL: https://datasheet.ciiva.com/931/nds7002a-931794.pdf?src-supplier=Digi-Key; ComponentLink12Description: https://datasheet.ciiva.com/931/nds7002a-931794.pdf?src-supplier=Digi-Key; ComponentLink13URL: https://datasheet.ciiva.com/931/nds7002a-931795.pdf?src-supplier=Digi-Key; ComponentLink13Description: https://datasheet.ciiva.com/931/nds7002a-931795.pdf?src-supplier=Digi-Key; ComponentLink14URL: https://datasheet.ciiva.com/931/nds7002a-931796.pdf?src-supplier=Digi-Key; ComponentLink14Description: https://datasheet.ciiva.com/931/nds7002a-931796.pdf?src-supplier=Digi-Key; ComponentLink15URL: https://datasheet.ciiva.com/4441/2n7002-8405-4441164.pdf?src-supplier=Mouser; ComponentLink15Description: https://datasheet.ciiva.com/4441/2n7002-8405-4441164.pdf?src-supplier=Mouser; ComponentLink16URL: https://datasheet.ciiva.com/46382/660093-46382951.pdf?src-supplier=Element14; ComponentLink16Description: https://datasheet.ciiva.com/46382/660093-46382951.pdf?src-supplier=Element14; ComponentLink17URL: https://datasheet.ciiva.com/16801/nds7002a-16801806.pdf?src-supplier=Future+Electronics; ComponentLink17Description: https://datasheet.ciiva.com/16801/nds7002a-16801806.pdf?src-supplier=Future+Electronics; ComponentLink18URL: https://datasheet.ciiva.com/22681/660093-22681829.pdf?src-supplier=Element14; ComponentLink18Description: https://datasheet.ciiva.com/22681/660093-22681829.pdf?src-supplier=Element14; ComponentLink19URL: https://datasheet.ciiva.com/22681/660093-22681830.pdf?src-supplier=Element14; ComponentLink19Description: https://datasheet.ciiva.com/22681/660093-22681830.pdf?src-supplier=Element14; ComponentLink20URL: https://datasheet.ciiva.com/28548/660093-28548223.pdf?src-supplier=Element14; ComponentLink20Description: https://datasheet.ciiva.com/28548/660093-28548223.pdf?src-supplier=Element14
R500-R505 R512 R513 = RES_0805_R_330.00: RES 330 OHM 1% 1/8W 0805; Manufacturer 1: Stackpole Electronics; Manufacturer Part Number 1: RMCF0805FT330R; Temperature Coefficient: 100ppm/°C; Resistance: 330R; Max Power Dissipation: 125mW; Features: Automotive AEC-Q200; Number of Terminations: 2; RoHS: Yes; Packaging: Tape and Reel; Tolerance: 1%; Category: Chip SMD Resistors; Supplier 1: Digi-Key; Supplier Part Number 1: RMCF0805FT330RCT-ND; Stock 1: 205996; Pricing 1: 1=0.10000, 10=0.02700, 100=0.01090, 1000=0.00488, 2500=0.00423 (USD); Mount: Surface Mount; Case/Package: 0805; Case Code (Metric): 2012; Case Code (Imperial): 0805; Contact Plating: Tin,Matte; Min Operating Temperature: -55°C; Max Operating Temperature: 155°C; Resistor Type: Thick Film; Series: RMCF; Construction: Rectangular; Length: 0.079inch; Width: 0.049inch; Height: 0.026inch; Depth: 1.25mm; Radiation Hardening: No; Military Standard: Not; Lead Free: Lead Free; RoHS Compliant: Yes; ComponentLink1URL: http://components.arrow.com/part/dataview/40963487S9848862N1174?src-supplier=Arrow+Electronics; ComponentLink1Description: http://components.arrow.com/part/dataview/40963487S9848862N1174?src-supplier=Arrow+Electronics; ComponentLink2URL: https://www.seielect.com/catalog/SEI-RMCF_RMCP.pdf?src-supplier=Avnet; ComponentLink2Description: https://www.seielect.com/catalog/SEI-RMCF_RMCP.pdf?src-supplier=Avnet; ComponentLink3URL: https://www.seielect.com/Catalog/SEI-RMCF_RMCP.pdf?src-supplier=Digi-Key; ComponentLink3Description: https://www.seielect.com/Catalog/SEI-RMCF_RMCP.pdf?src-supplier=Digi-Key; ComponentLink4URL: https://www.seielect.com/catalog/SEI-Packaging.pdf?src-supplier=Digi-Key; ComponentLink4Description: https://www.seielect.com/catalog/SEI-Packaging.pdf?src-supplier=Digi-Key; ComponentLink5URL: https://www.verical.com/server-webapp/html/getDatasheet?partID=559884&src-supplier=Verical; ComponentLink5Description: https://www.verical.com/server-webapp/html/getDatasheet?partID=559884&src-supplier=Verical
R506-R511 R514 R515 = RES_0805_K_010.00: as R400 on sheet 04_Seven_Seg; Supplier 1: Digi-Key; Supplier Part Number 1: 311-10.0KCRCT-ND; Stock 1: 7562122; Pricing 1: 1=0.10000, 10=0.04200, 100=0.01690, 1000=0.00759, 2500=0.00659 (USD); RoHS: Yes; Case/Package: 0805; Case Code (Imperial): 0805; Case Code (Metric): 2012; Min Operating Temperature: -55°C; Max Operating Temperature: 155°C; Tolerance: 1%; Packaging: Tape and Reel; Features: Moisture Resistant; Termination: SMD/SMT; Number of Terminations: 2; Military Standard: Not; Max Power Dissipation: 125mW; Package Quantity: 1; Length: 2mm; Height: 0.024inch; Width: 0.049inch; Depth: 1.25mm; Lead Free: Lead Free; REACH SVHC: Unknown; ComponentLink1URL: https://datasheet.ciiva.com/11808/0900766b8106beab-11808151.pdf?src-supplier=RSComponents; ComponentLink1Description: https://datasheet.ciiva.com/11808/0900766b8106beab-11808151.pdf?src-supplier=RSComponents; ComponentLink2URL: https://datasheet.ciiva.com/12669/rc0805-12669688.pdf?src-supplier=Mouser; ComponentLink2Description: https://datasheet.ciiva.com/12669/rc0805-12669688.pdf?src-supplier=Mouser; ComponentLink3URL: https://datasheet.ciiva.com/46447/444164-46447563.pdf?src-supplier=Element14; ComponentLink3Description: https://datasheet.ciiva.com/46447/444164-46447563.pdf?src-supplier=Element14; ComponentLink4URL: https://datasheet.ciiva.com/2456/pyu-r-int-thick-7-2456972.pdf?src-supplier=Digi-Key; ComponentLink4Description: https://datasheet.ciiva.com/2456/pyu-r-int-thick-7-2456972.pdf?src-supplier=Digi-Key; ComponentLink5URL: https://datasheet.ciiva.com/2456/pyu-r-int-thick-7-2456973.pdf?src-supplier=Digi-Key; ComponentLink5Description: https://datasheet.ciiva.com/2456/pyu-r-int-thick-7-2456973.pdf?src-supplier=Digi-Key; ComponentLink6URL: https://datasheet.ciiva.com/2456/pyu-r-int-thick-7-2456974.pdf?src-supplier=Digi-Key; ComponentLink6Description: https://datasheet.ciiva.com/2456/pyu-r-int-thick-7-2456974.pdf?src-supplier=Digi-Key; ComponentLink7URL: https://datasheet.ciiva.com/16747/rc0805-16747087.pdf?src-supplier=Future+Electronics; ComponentLink7Description: https://datasheet.ciiva.com/16747/rc0805-16747087.pdf?src-supplier=Future+Electronics; Category: Chip SMD Resistors; Size Code: 0805; Resistor Type: Thick Film; Series: RC; Construction: Rectangular; Resistance Tolerance: 1%; Technology: THICK FILM; RoHS Compliant: Yes